# EAGLE design relay_pa2 (EAGLE 4.15)
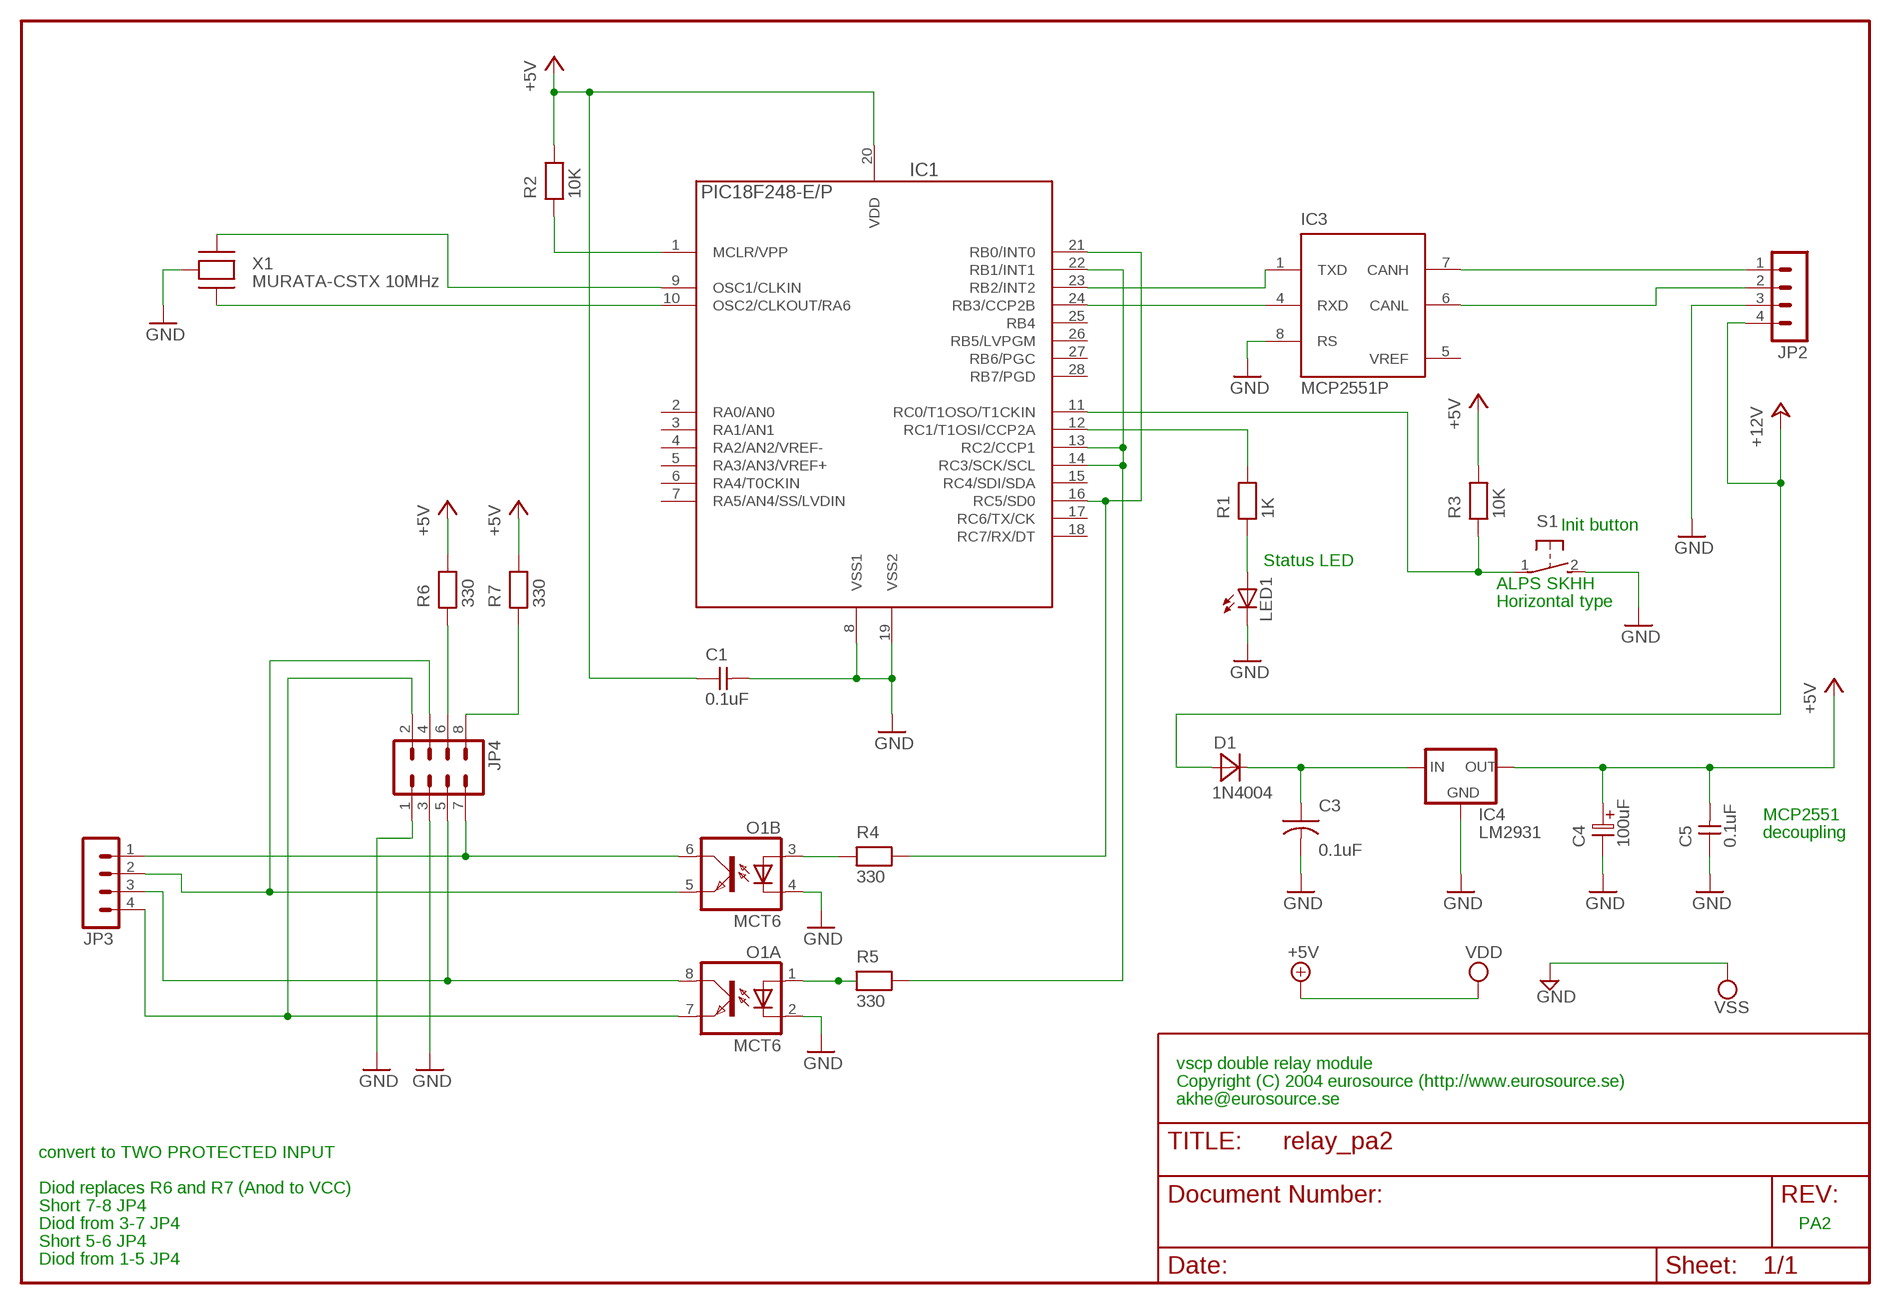
[diagram p0: schematic, sheet 1]

## Parts
C1  0.1uF  CAPNP-2,5  [C-2,5]
C3  0.1uF  CAP-5  [C-5]
C4  100uF  ELC-5  [ES-5]
C5  0.1uF  CAPNP-2,5  [C-2,5]
D1  1N4004  DIODE-10  [D-10]
IC1  PIC18F248-E/P  PIC18F252-E/P  [PDIP-28]
IC3  MCP2551P  [DIL8]
IC4  LM2931  78LXX  [78LXX]
JP2  MA04-1  [MA04-1]
JP3  MA04-1  [MA04-1]
JP4  MA04-2  [MA04-2]
LED1  LED3MM  [LED3MM]
O1  MCT6  ILD621  [DIL08]
R1  1K  RESEU-10  [R-10]
R2  10K  RESEU-10  [R-10]
R3  10K  RESEU-10  [R-10]
R4  330  RESEU-10  [R-10]
R5  330  RESEU-10  [R-10]
R6  330  RESEU-10  [R-10]
R7  330  RESEU-10  [R-10]
S1  31-XX  [B3F-31XX]
X1  MURATA-CSTX 10MHz  MURATA-CSTX  [RESONATOR-MURATA]

## Nets
+5V: C1.1 C4.1 C5.2 IC1.20(VDD) IC4.OUT R2.2 R3.2 R6.2 R7.2 ; supply symbol labelled VDD
+12V: D1.1(A) JP2.4
CANH: IC3.7(CANH) JP2.1
CANL: IC3.6(CANL) JP2.2
GND: C1.2 C3.2 C4.2 C5.1 IC1.8(VSS1) IC1.19(VSS2) IC3.8(RS) IC4.GND JP2.3 JP4.1 JP4.3 LED1.K(C) O1.2(A:C) O1.4(B:C) S1.2(S) X1.2(GND) ; supply symbol labelled VSS
N$1: LED1.A R1.1
N$2: IC1.12(RC1/T1OSI/CCP2A) R1.2
N$3: IC1.10(OSC2/CLKOUT/RA6) X1.3(XTOUT)
N$4: IC1.1(MCLR/VPP) R2.1
N$6: IC1.11(RC0/T1OSO/T1CKIN) R3.1 S1.1(P)
N$9: O1.3(B:A) R4.1
N$10: O1.1(A:A) R5.1
N$11: C3.1 D1.2(K) IC4.IN
N$12: JP3.1 JP4.7 O1.6(B:COL)
N$13: JP3.3 JP4.5 O1.8(A:COL)
N$14: JP3.2 JP4.4 O1.5(B:EMIT)
N$15: JP3.4 JP4.2 O1.7(A:EMIT)
N$16: JP4.6 R6.1
N$17: JP4.8 R7.1
OSC1: IC1.9(OSC1/CLKIN) X1.1(XTIN)
RXCAN: IC1.24(RB3/CCP2B) IC3.4(RXD)
SCK: IC1.13(RC2/CCP1) IC1.14(RC3/SCK/SCL) IC1.22(RB1/INT1) R5.2
SDO: IC1.16(RC5/SD0) IC1.21(RB0/INT0) R4.2
TXCAN: IC1.23(RB2/INT2) IC3.1(TXD)
Unconnected: IC1.2(RA0/AN0) IC1.3(RA1/AN1) IC1.4(RA2/AN2/VREF-) IC1.5(RA3/AN3/VREF+) IC1.6(RA4/T0CKIN) IC1.7(RA5/AN4/SS/LVDIN) IC1.15(RC4/SDI/SDA) IC1.17(RC6/TX/CK) IC1.18(RC7/RX/DT) IC1.25(RB4) IC1.26(RB5/LVPGM) IC1.27(RB6/PGC) IC1.28(RB7/PGD)

## Notes on the sheet
- Init button
- Status LED
- ALPS SKHH
- Horizontal type
- MCP2551
- decoupling
- vscp double relay module
- Copyright (C) 2004 eurosource (http://www.eurosource.se)
- akhe@eurosource.se
- convert to TWO PROTECTED INPUT
- Diod replaces R6 and R7 (Anod to VCC)
- Short 7-8 JP4
- Diod from 3-7 JP4 | PA2
- Short 5-6 JP4
- Diod from 1-5 JP4

## Power pins joined to a net without a drawn wire
+5V: IC3.3(VDD)
GND: IC3.2(VSS)
VREF: IC3.5(VREF)

## Library data of the parts
C1 C5 = discrete:CAPNP-2,5
C3 = discrete:CAP-5
C4 = discrete:ELC-5
D1 = discrete:DIODE-10
IC1 = pic18:PIC18*F252-?: 18F252, 28 pin, 32Kb prog, 1536 data, 256 EEPROM
IC3 = microchip_can:MCP2551: High Speed CAN tranceiver
IC4 = v-reg:78LXX: VOLTAGE REGULATOR
JP2 JP3 = con-lstb:MA04-1
JP4 = con-lstb:MA04-2: PIN HEADER
LED1 = led:LED: LED OSRAM: - CHIPLED LG R971, LG N971, LY N971, LG Q971, LY Q971, LO R971, LY R971 LH N974, LH R974 LS Q976, LO Q976, LY Q976 LO Q996 - Hyper CHIPLED LW Q18S LB Q993, LB Q99A, LB R99A - SideLED LS A670, LO A670, LY A670, LG A670, LP A670 LB A673, LV A673, LT A673, LW A673 LH A674 LY A675 LS A676, LA A676, LO A676, LY A676, LW A676 LS A679, LY A679, LG A679 - Hyper Micro SIDELED® LS Y876, LA Y876, LO Y876, LY Y876 LT Y87S - SmartLED LW L88C, LW L88S LB L89C, LB L89S, LG L890 LS L89K, LO L89K, LY L89K LS L896, LA L896, LO L896, LY L896 - TOPLED LS T670, LO T670, LY T670, LG T670, LP T670 LSG T670, LSP T670, LSY T670, LOP T670, LYG T670 LG T671, LOG T671, LSG T671 LB T673, LV T673, LT T673, LW T673 LH T674 LS T676, LA T676, LO T676, LY T676, LB T676, LH T676, LSB T676, LW T676 LB T67C, LV T67C, LT T67C, LS T67K, LO T67K, LY T67K, LW E67C LS E67B, LA E67B, LO E67B, LY E67B, LB E67C, LV E67C, LT E67C LW T67C LS T679, LY T679, LG T679 LS T770, LO T770, LY T770, LG T770, LP T770 LB T773, LV T773, LT T773, LW T773 LH T774 LS E675, LA E675, LY E675, LS T675 LS T776, LA T776, LO T776, LY T776, LB T776 LHGB T686 LT T68C, LB T68C - Hyper Mini TOPLED® LB M676 - Mini TOPLED Santana® LG M470 LS M47K, LO M47K, LY M47K Source: http://www.osram.convergy.de/
O1 = optocoupler:ILD621: SIEMENS OPTO COUPLER
R1-R7 = discrete:RESEU-10
S1 = switch-omron:31-XX: OMRON SWITCH
X1 = eurosource_ftdi:MURATA-CSTX

## Board
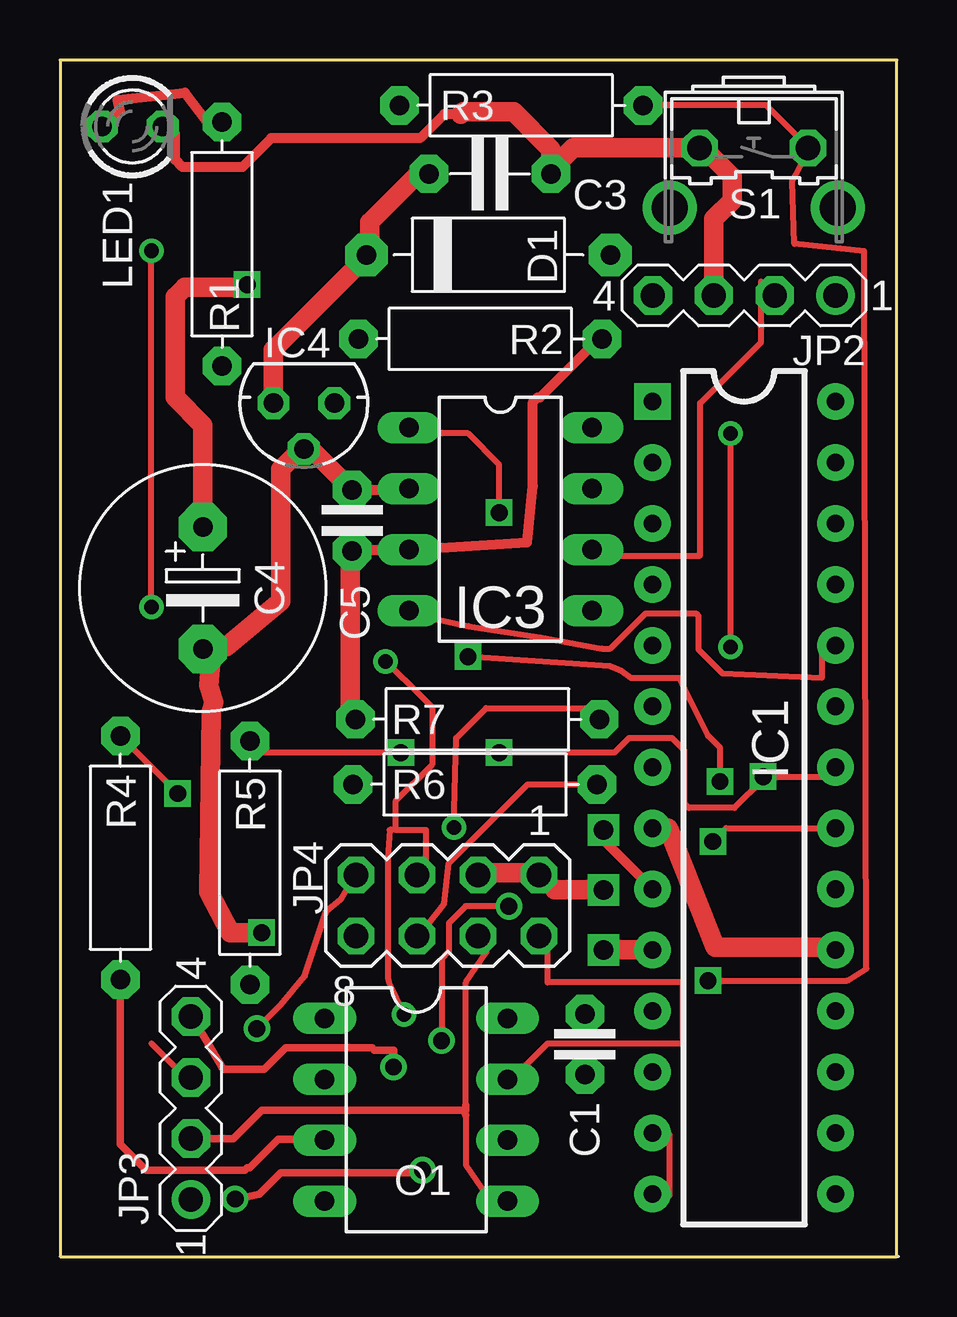
[diagram p1: board, top side]
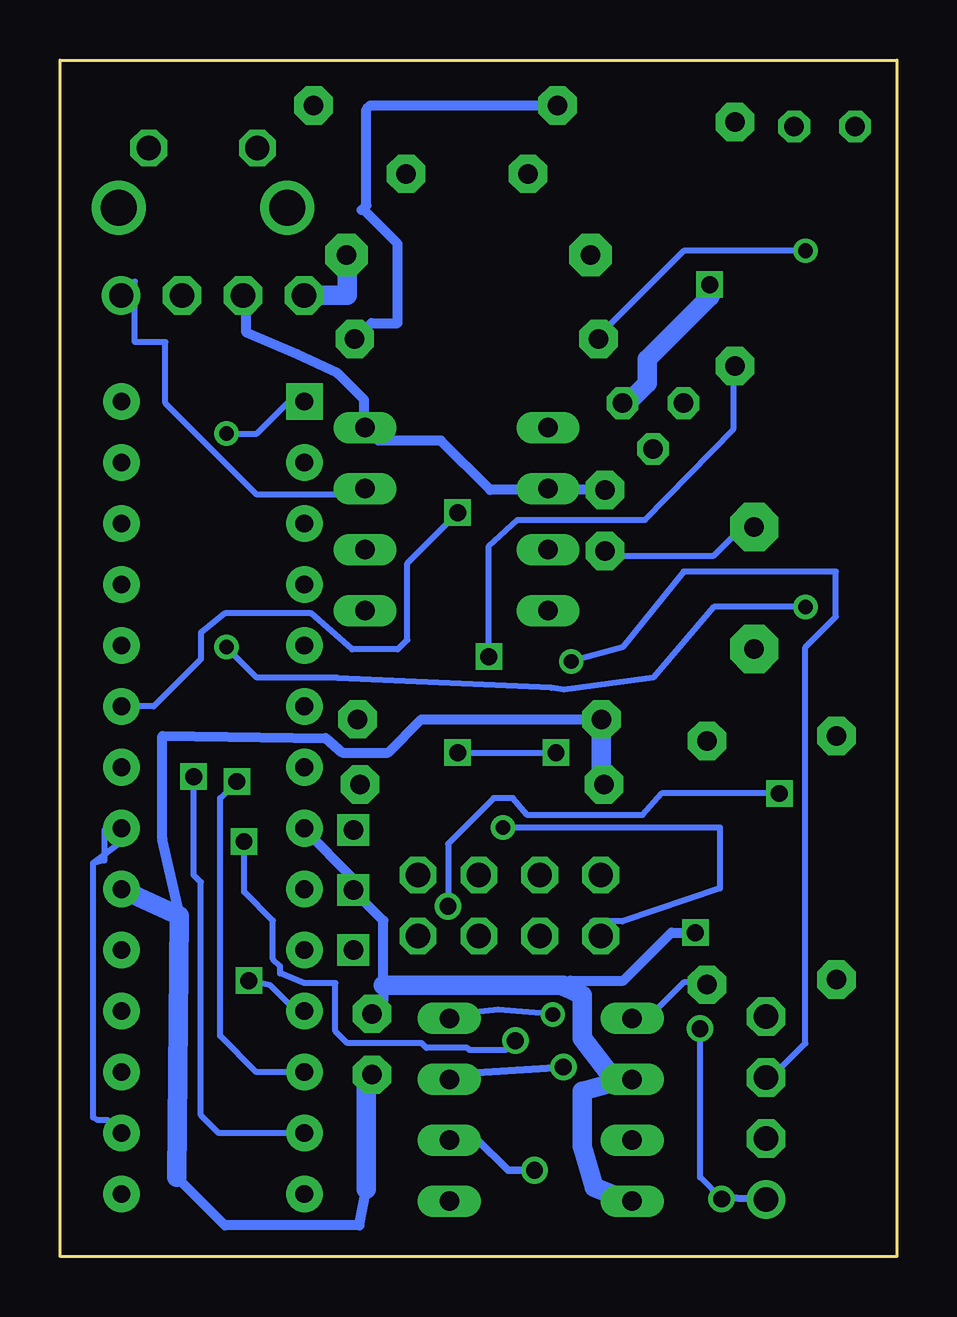
[diagram p2: board, bottom side, seen from below]

Size 34.87 x 49.86 mm. Coordinates in mm from the lower left corner, seen from the top.
Copper layers (1*16): Top 0.035mm / dielectric 1.5mm / Bottom 0.035mm
Design rules "10mils": minimum track width 10mil, minimum drill 24mil, track to track 10mil, track to pad 10mil, pad to pad 10mil, via to via 10mil, smd to smd 10mil, copper to edge 40mil, drill to drill 10mil, minimum pad ring 10mil, minimum via ring 8mil, stop-mask expansion 0mil, vias tented up to drill 0mil, thermal gap 10mil

### Footprints (pad centres in the part's own frame; a part is rotated, then mirrored left to right if it is on the bottom)
C-2,5 = drill 0.813 pad 1.6 octagon: 1 -1.27,0; 2 1.27,0
C-5 = drill 0.813 pad 1.6 octagon: 1 -2.54,0; 2 2.54,0
ES-5 = drill 0.813 pad 2.007 octagon: 1 -2.54,0; 2 2.54,0
D-10 = drill 0.813 pad 1.778 octagon: 1 -5.08,0; 2 5.08,0
PDIP-28 = drill 0.737 pad 1.524 square: 1 -17.78,-3.81 | drill 0.737 pad 1.524 round: 2 -15.24,-3.81; 3 -12.7,-3.81; 4 -10.16,-3.81; 5 -7.62,-3.81; 6 -5.08,-3.81; 7 -2.54,-3.81; 8 0,-3.81; 9 2.54,-3.81; 10 5.08,-3.81; 11 7.62,-3.81; 12 10.16,-3.81; 13 12.7,-3.81; 14 15.24,-3.81; 15 15.24,3.81; 16 12.7,3.81; 17 10.16,3.81; 18 7.62,3.81; 19 5.08,3.81; 20 2.54,3.81; 21 0,3.81; 22 -2.54,3.81; 23 -5.08,3.81; 24 -7.62,3.81; 25 -10.16,3.81; 26 -12.7,3.81; 27 -15.24,3.81; 28 -17.78,3.81
DIL8 = drill 0.813 long: 1 -3.81,-3.81; 2 -1.27,-3.81; 3 1.27,-3.81; 4 3.81,-3.81; 5 3.81,3.81; 6 1.27,3.81; 7 -1.27,3.81; 8 -3.81,3.81
78LXX = drill 0.813 octagon: GND 0,1.905; IN 1.27,0; OUT -1.27,0
MA04-1 = drill 1.016 pad 1.6 round: 1 -3.81,0 | drill 1.016 pad 1.6 octagon: 2 -1.27,0; 3 1.27,0; 4 3.81,0
MA04-2 = drill 1.016 octagon: 1 -3.81,-1.27; 2 -3.81,1.27; 3 -1.27,-1.27; 4 -1.27,1.27; 5 1.27,-1.27; 6 1.27,1.27; 7 3.81,-1.27; 8 3.81,1.27
LED3MM = drill 0.813 octagon: A -1.27,0; K 1.27,0
DIL08 = drill 0.813 long: 1 -3.81,-3.81; 2 -1.27,-3.81; 3 1.27,-3.81; 4 3.81,-3.81; 5 3.81,3.81; 6 1.27,3.81; 7 -1.27,3.81; 8 -3.81,3.81
R-10 = drill 0.813 pad 1.6 octagon: 1 -5.08,0; 2 5.08,0
B3F-31XX = drill 1.016 octagon: 1 -2.261,-1.245; 2 2.261,-1.245 | drill 1.499 pad 2.159 round: 3 -3.505,1.245; 4 3.505,1.245
RESONATOR-MURATA = drill 0.813 square: 1 0,0; 2 2.5,0; 3 5,0

### Placement (x,y rotation side)
C1  21.87,8.85 90 top
C3  17.91,45.12 0 top
C4  5.95,27.86 270 top
C5  12.17,30.68 270 top
D1  17.85,41.74 180 top
IC1  28.5,17.85 270 top
IC3  18.35,30.73 270 top
IC4  10.16,35.56 180 top
JP2  28.51,40.05 180 top
JP3  5.45,6.19 90 top
JP4  16.15,14.63 180 top
LED1  3.01,47.09 0 top
O1  14.84,6.12 270 top
R1  6.75,42.19 270 top
R2  17.51,38.24 0 top
R3  19.22,47.97 180 top
R4  2.52,16.62 90 top
R5  7.91,16.41 90 top
R6  17.29,19.68 180 top
R7  17.39,22.39 180 top
S1  28.91,44.95 180 top
U$1  [DIN_THIN]  0,0 0 top
X1  22.65,17.78 270 top

### Tracks (layer width: path | path; a pad name or v marks a point on that pad's centre or on a via)
+5V  (via drill 0.7)
  Top 0.406: 12.1,29.3 12.17,29.37 | 12.17,29.37 C5.2 | 12.17,29.37 12.26,29.46 IC3.3 19.46,29.76 19.7,32.1 19.7,35.6 19.9,35.8 20,35.8 22.59,38.39 | 22.59,38.39 22.6,38.4 | 22.59,38.39 R2.2
  Top 0.813: 12.31,22.29 12.4,22.2 | R7.2 12.31,22.29 | 12.1,29.3 12.1,22.5 12.31,22.29 | C4.1 5.95,34.65 4.8,35.8 4.8,40 5.2,40.4 7.7,40.4 v7.8,40.5
  Bottom 0.254: C4.1 6.35,30.48 7.62,29.21 11.43,29.21 C5.2
  Bottom 0.406: R3.2 21.93,47.97 22.1,47.8 22.1,43.8 22.3,43.6 22.2,43.6 20.8,42.2 20.8,38.9 21.9,38.9 22.59,38.21 | 22.59,38.21 22.6,38.2 | R2.2 22.59,38.21 | 30,3.3 28,1.3 22.4,1.3 22.1,2.8 | R7.2 19.81,22.39 21.2,21 23.1,21 23.8,21.6 30.6,21.7 30.6,17.4 29.9,14.3 29.9,14.2
  Bottom 0.813: R6.2 12.12,19.68 12.1,19.7 12.31,19.91 R7.2 | IC1.20 29.9,14.2 30,3.3 | 21.72,7.58 21.7,7.6 | 21.72,7.58 C1.1 | 22.1,2.8 22.1,7.2 21.72,7.58 | v7.8,40.5 7.8,40 10.4,37.4 10.4,36.4 11.3,35.5 11.36,35.56 IC4.OUT
+12V
  Bottom 0.813: 22.9,41.74 22.9,41.8 | 22.9,41.74 D1.1 | JP2.4 22.9,40.05 22.9,41.74
CANH
  Bottom 0.254: IC3.7 22.86,31.75 26.67,31.75 30.48,35.56 30.48,38.1 31.75,38.1 31.75,40.64 JP2.1
CANL
  Top 0.254: IC3.6 22.86,29.21 26.67,29.21 26.67,35.56 29.21,38.1 29.21,40.64 JP2.2
GND  (via drill 0.7)
  Top 0.406: 16.7,47.6 16,47.6 15,46.6 8.8,46.6 7.6,45.4 5.1,45.4 4.8,45.7 4.8,46.8 4.4,47.2 LED1.K | IC3.2 14.7,32 14.65,31.95 C5.1 | 19.96,15.94 19.9,16 | 19.96,15.94 JP4.1 | 20.62,15.28 19.96,15.94 | JP4.3 17.4,15.9 17.5,16 | IC1.8 25.35,17.85 | 32.63,12.77 32.7,12.7 | 32.63,12.77 IC1.19 | 32.5,12.9 32.63,12.77
  Top 0.813: JP2.3 27.24,43.24 28,44 28,45 26.8,46.2 S1.2 21.39,46.2 20.32,45.12 | 20.32,45.12 20.2,45 | 20.32,45.12 C3.2 20.45,46.15 18.9,47.7 16.8,47.7 16.7,47.6 | X1.2 20.62,15.28 | 19.9,16 17.5,16 | 25.35,17.85 27.3,12.9 32.5,12.9 | 6.92,25.42 C4.2 | 6.92,25.42 9.2,27.3 9.2,32.8 10.1,33.7 10.14,33.66 IC4.GND 10.45,33.66 12.17,31.93 | 12.17,31.93 12.2,31.9 | 12.17,31.93 C5.1 | 6.92,25.42 6.32,25.22 6.2,23.8 6.4,23.1 6.3,22.7 6.2,15.2 7.1,13.5 v8.4,13.5
  Bottom 0.406: IC1.8 24.69,17.81 24.7,17.8 22.65,15.75 X1.2 22.65,15.25 21.4,14 21.4,11.3 21.4,10.7 21.5,10.6 21.5,10.4 21.87,10.03 | 21.87,10.03 21.9,10 | 21.87,10.03 C1.2 | C5.1 16.95,31.95 19,34 21.6,34 22.16,34.56 | 22.16,34.56 22.2,34.6 22.2,35.7 23.3,36.8 25,37.6 27.1,38.5 27.1,39.8 27.35,40.05 | 22.16,34.56 IC3.8 | 27.35,40.05 27.4,40.1 | 27.35,40.05 JP2.3 | v8.4,13.5 9.4,13.5 11.4,11.5 13.6,11.5 13.85,11.25
  Bottom 0.813: 11.29,7.39 13.1,6.9 13.1,4.6 12.6,2.9 10.9,2.2 11.03,2.17 | 11.03,2.17 11.1,2.1 | O1.4 11.03,2.17 | 11.29,7.39 O1.2 | 11.29,7.39 11.79,7.39 13.1,9.1 13.1,10.9 13.85,11.25 13.9,11.3 21.4,11.3
N$1
  Top 0.406: R1.1 6.13,47.27 5.2,48.5 2.4,48.2 2.5,47.7 1.4,47.1 1.41,47.09 LED1.A
N$2  (via drill 0.7)
  Top 0.254: v27.5,19.8 27.5,21.2 27,21.7 25.8,24.1 23.8,24.1 23.4,24.4 22.9,24.6 v17,25
  Bottom 0.254: IC1.12 26.69,7.69 28.2,9.2 28.2,19.1 v27.5,19.8 | v17,25 17,29.6 15.8,30.7 10.5,30.7 6.8,34.5 6.8,37.3 6.75,37.25 R1.2
N$3
  Top 0.406: 24.69,12.61 24.8,12.5 | 24.69,12.61 IC1.10 | 24.52,12.78 24.69,12.61
  Top 0.813: X1.3 24.52,12.78
N$4  (via drill 0.61)
  Top 0.254: v27.94,25.4 v27.94,34.29 | v3.81,27.07 v3.81,41.91
  Bottom 0.254: v27.94,34.29 26.67,34.29 25.4,35.56 IC1.1 | v27.94,25.4 26.67,24.13 23.33,24.13 23.3,24.1 14.4,23.7 13.87,23.63 10.16,24.13 7.62,27.07 v3.81,27.07 | v3.81,41.91 8.89,41.91 12.7,38.1 R2.1
N$6  (via drill 0.7)
  Top 0.254: R3.1 29.43,47.97 31.2,46.2 S1.1 31.2,46.09 30.5,44.8 30.6,42.2 33.5,41.9 33.6,12 32.8,11.5 v27,11.5
  Bottom 0.254: 24.73,9.93 24.6,10.2 | 24.73,9.93 IC1.11 | v27,11.5 26.1,11.3 24.73,9.93
N$9
  Top 0.305: R4.1 2.52,4.68 3.6,3.6 7.7,3.6 7.8,3.7 7.9,3.7 9.1,4.9 11,4.9 11.05,4.85 | 11.05,4.85 11.1,4.8 | 11.05,4.85 O1.3
N$10
  Bottom 0.254: O1.1 10.16,10.16 8.89,11.43 7.62,11.43 R5.1
N$11
  Top 0.813: C3.1 14.92,45.12 12.9,43.1 12.9,42 12.7,41.8 D1.2 12.84,41.74 | 12.84,41.74 12.9,41.8 | IC4.IN 8.89,37.79 12.84,41.74
N$12  (via drill 0.7)
  Top 0.254: v8.2,9.5 9.2,10.5 10.2,11.7 11.1,14.4 11.7,14.9 11.73,14.94 12.1,15.54 JP4.7
  Top 0.305: v7.3,2.4 8.3,2.6 9.2,3.5 15,3.5 v15.1,3.6
  Bottom 0.254: JP4.7 12.4,15.9 12.5,15.8 12.5,15.7 | v8.2,9.5 8.2,3.3 v7.3,2.4
  Bottom 0.305: 18.7,4.9 O1.6 18.6,4.9 17.5,4.9 16.2,3.6 v15.1,3.6 | JP3.1 7.42,2.48 v7.3,2.4
N$13  (via drill 0.61)
  Top 0.254: v14.34,10.09 13.7,11.43 13.66,11.63 13.66,16.61 13.73,17.78 13.97,17.78 | 13.97,17.78 15.24,17.78 15.24,16.51 JP4.5 | v13.57,24.8 15.1,23.3 15.5,22.9 15.5,20.5 13.97,18.97 13.97,17.78 | 3.81,8.89 5.08,7.62 JP3.3
  Bottom 0.254: v14.34,10.09 16.61,10.29 17.78,10.16 O1.8 | v13.57,24.8 11.43,25.4 8.89,28.54 2.54,28.54 2.54,26.67 3.81,25.4 3.81,8.89 5.08,7.62 JP3.3
N$14
  Top 0.254: O1.5 17.78,2.54 16.91,3.81 16.91,5.9 16.91,6.3 16.91,11.43 17.78,12.7 JP4.4
  Top 0.305: 16.91,6.3 16.9,6.1 16.8,6.1 | JP3.2 7.22,4.92 8.4,6.1 16.8,6.1 | 16.8,6.1 16.91,5.9
N$15  (via drill 0.7)
  Top 0.254: O1.7 19.05,7.62 20.32,8.89 25.97,8.89 25.97,11.43 20.32,11.43 20.32,12.7 JP4.2
  Top 0.305: JP3.4 5.5,10 6.8,7.8 8.5,7.8 9.4,8.7 13,8.7 13.1,8.6 13.9,8.6 v13.9,7.9
  Bottom 0.305: O1.7 18.69,7.39 18.7,7.4 18.5,7.6 v13.9,7.9
N$16
  Top 0.254: R6.1 19.48,19.68 16.2,16.4 16,14.7 14.9,13.3 14.88,13.32 JP4.6
N$17  (via drill 0.61)
  Top 0.254: v16.41,17.88 16.5,21.6 17.76,22.86 22.16,22.86 | 22.16,22.86 22.56,22.36 | 22.16,22.86 22.1,22.8 R7.1
  Bottom 0.254: v16.41,17.88 7.36,17.88 7.36,15.34 11.43,13.97 12.7,13.97 JP4.8
OSC1
  Top 0.406: IC1.9 22.65,17.35 X1.1
RXCAN
  Top 0.254: IC3.4 15.24,26.67 17.02,26.27 20.02,25.8 22.59,25.33 22.93,25.33 24.4,26.8 26.5,26.8 26.6,26.7 26.6,25.3 27.6,24.3 31.75,24.13 31.75,25.4 IC1.24
SCK  (via drill 0.7)
  Top 0.254: IC1.14 25.4,2.54 25.4,5.08 IC1.13 | IC1.22 32.31,20.31 32,20 v29.3,20 29.3,19.9 28.1,18.7 26.2,18.7 26,18.9 26,21.1 25.5,21.6 23.7,21.6 23.1,21 v18.3,21 | R5.2 7.99,21.49 8,21.5 8.5,21 v14.2,21
  Bottom 0.254: IC1.13 28.25,5.15 29,5.9 29,15.6 29.3,15.9 v29.3,20 | v18.3,21 v14.2,21
SDO  (via drill 0.7)
  Top 0.254: R4.2 2.5,21.7 v4.9,19.3 | IC1.21 27.75,17.85 v27.2,17.3 | v15.9,9 15.9,12.4 16.2,12.7 16.2,13.9 16.9,14.6 v18.7,14.6
  Bottom 0.254: 33.5,16.4 32.31,17.29 | 33.5,16.4 33.5,5.8 33.3,5.7 32.9,5.7 32.31,5.11 | 32.31,5.11 32.3,5.1 | 32.31,5.11 IC1.16 | v4.9,19.3 9.8,19.3 10.6,18.4 15.4,18.4 16,19.1 16.8,19.1 18.7,17.2 v18.7,14.6 | v27.2,17.3 27.2,15.2 26,14 26,12.4 25.7,12.1 25.7,11.8 24.7,11.4 23.4,11.4 23.4,9.4 22.9,8.9 19.8,8.9 19.6,8.7 17.9,8.7 17.8,8.6 16.3,8.6 v15.9,9 | 33.5,16.4 33.02,16.51 33.02,17.78 IC1.21
TXCAN  (via drill 0.7)
  Top 0.254: v18.3,31 18.3,33 17,34.3 15,34.3 14.7,34.6 14.64,34.54 IC3.1
  Bottom 0.254: IC1.23 30.97,22.93 29,24.9 29,26 28,26.8 24.4,26.8 22.7,25.3 20.8,25.3 20.4,25.7 20.4,28.9 v18.3,31